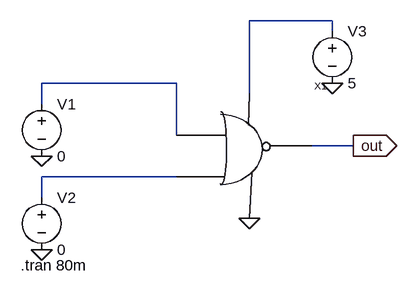
[diagram p0: schematic norgateimplytesting.asc]
norgateimplytesting.asc, the LTspice schematic file:
Version 4
SHEET 1 880 680
WIRE 384 -32 256 -32
WIRE 384 -16 384 -32
WIRE 144 64 -64 64
WIRE 256 80 256 -32
WIRE -64 96 -64 64
WIRE 144 144 144 64
WIRE 416 160 352 160
WIRE 144 208 -64 208
WIRE -64 240 -64 208
FLAG -64 176 0
FLAG -64 320 0
FLAG 384 64 0
FLAG 256 272 0
FLAG 416 160 out
IOPIN 416 160 Out
SYMBOL norgateimply 112 160 R0
SYMATTR InstName X1
SYMBOL voltage -64 80 R0
WINDOW 123 0 0 Left 0
WINDOW 39 0 0 Left 0
SYMATTR InstName V1
SYMATTR Value 0
SYMBOL voltage -64 224 R0
WINDOW 123 0 0 Left 0
WINDOW 39 0 0 Left 0
SYMATTR InstName V2
SYMATTR Value 0
SYMBOL voltage 384 -32 R0
WINDOW 123 0 0 Left 0
WINDOW 39 0 0 Left 0
SYMATTR InstName V3
SYMATTR Value 5
TEXT -96 344 Left 2 !.tran 80m

The netlist it stands for:
* norgateimplytesting.asc
XX1 N001 N002 N003 0 out norgateimply  ; pins VDD A B VSS OUT
V1 N002 0 0
V2 N003 0 0
V3 N001 0 5
.tran 80m
.backanno
.end